# EAGLE design irio (EAGLE 6.6.0)
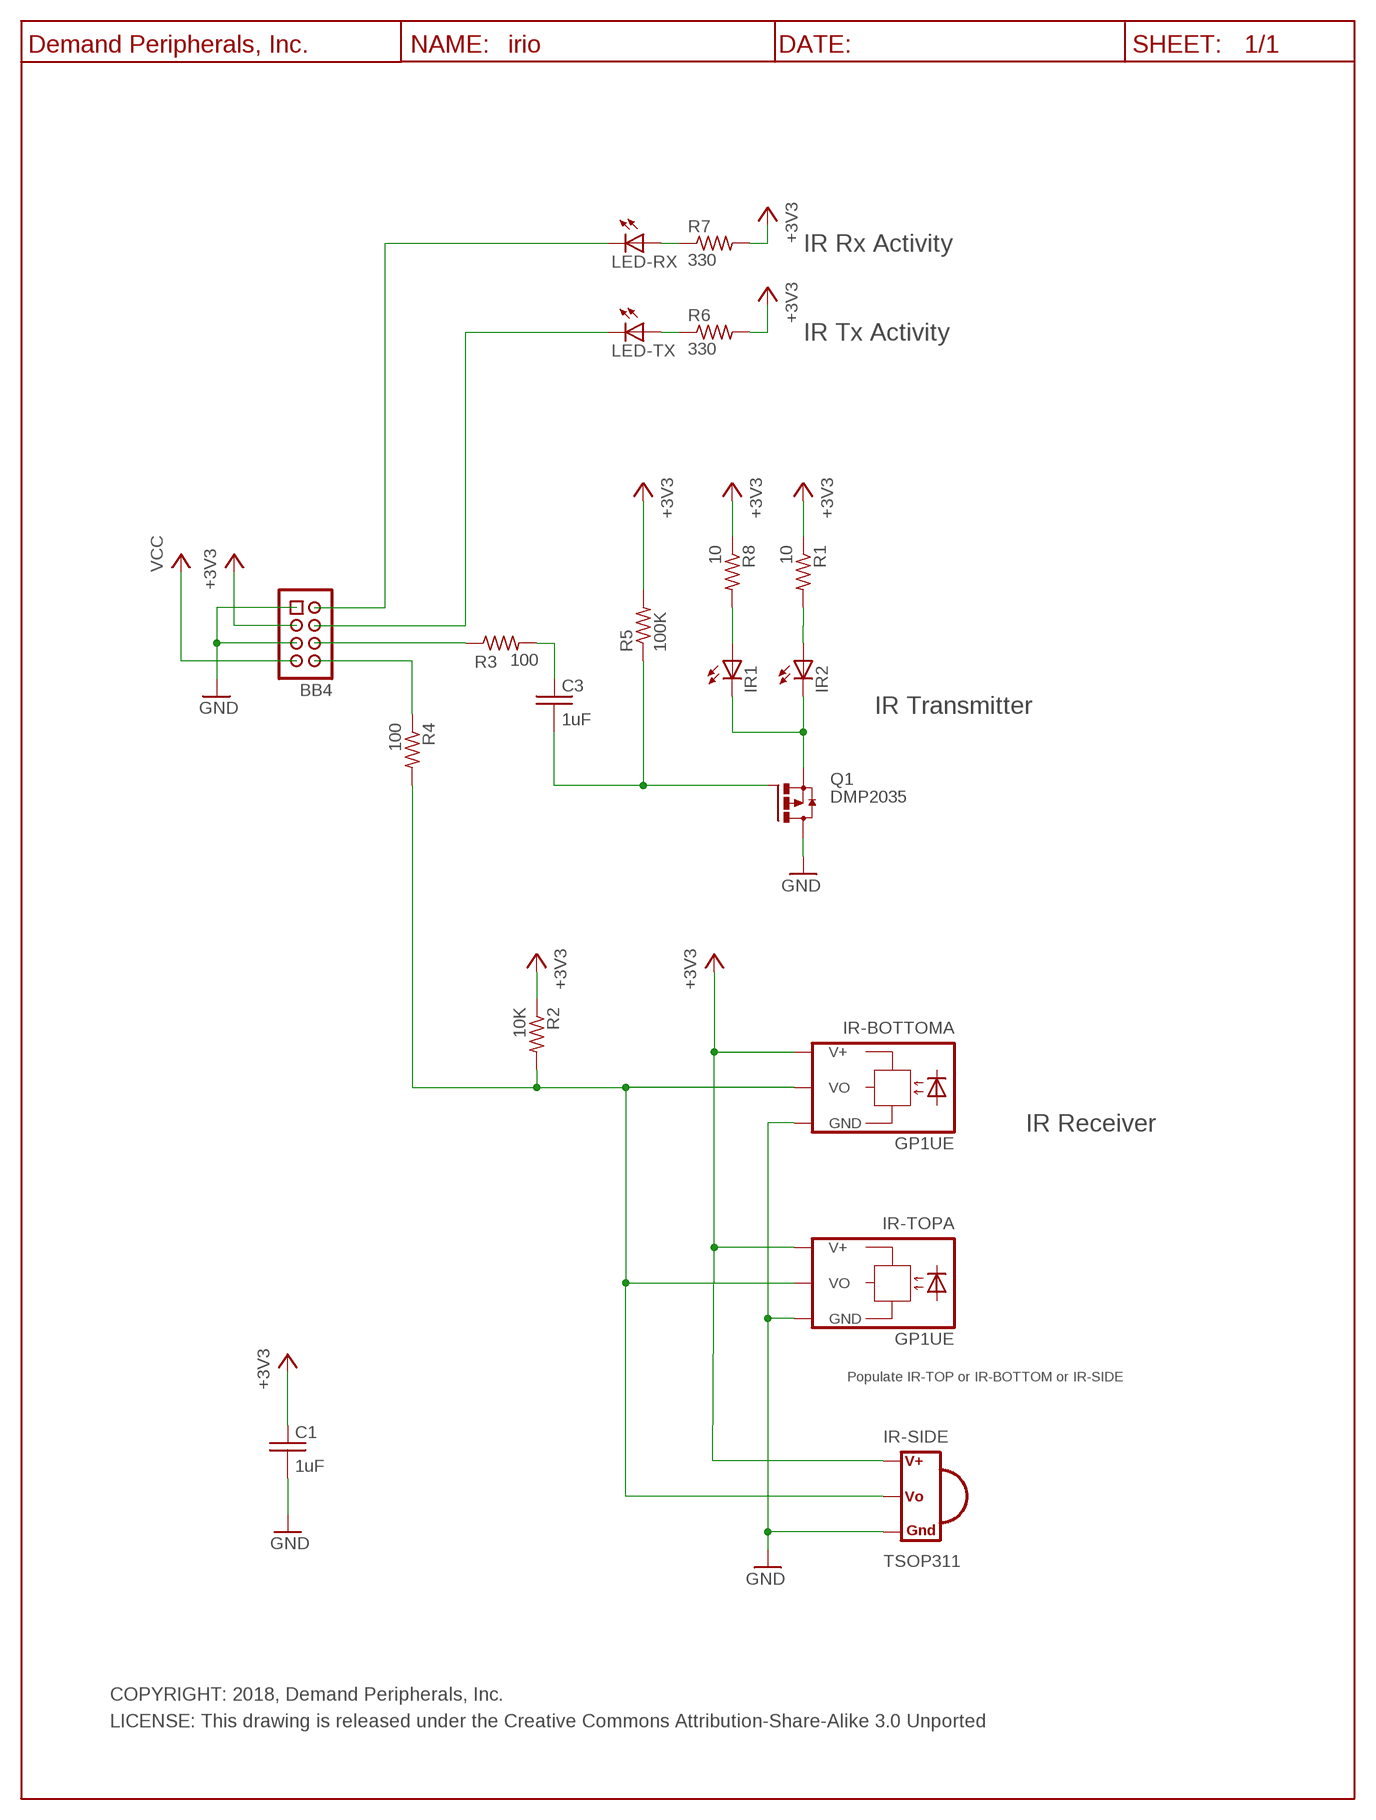
[diagram p0: schematic, sheet 1]

## Parts
BB4  BB4-CON  HDR-4X2-SHR  [HDR-4X2]
C1  1uF  C1.0UF_C0603  [C0603]
C3  1uF  C1.0UF_C0603  [C0603]
IR1  LED-5MM-IR  [LED5MM]
IR2  LED-5MM-IR  [LED5MM]
IR-BOTTOM  GP1UE  [GP1UE]
IR-SIDE  TSOP311  [TSOP-IR-SIDE]
IR-TOP  GP1UE  [GP1UE]
LED-RX  LED  LED-5MM-GRN  [LED5MM]
LED-TX  LED  LED-5MM-RED  [LED5MM]
Q1  DMP2035  [SOT23]
R1  10  R10_R0603  [R0603]
R2  10K  R10K_R0603  [R0603]
R3  100  R100_R0603  [R0603]
R4  100  R100_R0603  [R0603]
R5  100K  R100K_R0603  [R0603]
R6  330  R330_R0603  [R0603]
R7  330  R330_R0603  [R0603]
R8  10  R10_R0603  [R0603]
U$1  DP_FRAME_P  [P_FRAME]

## Nets
+3V3: BB4.3 C1.1 IR-BOTTOM.2(A:V+) IR-SIDE.2(V+) IR-TOP.2(A:V+) R1.1 R2.1 R5.2 R6.2 R7.2 R8.1
GND: BB4.1 BB4.5 C1.2 IR-BOTTOM.3(A:GND) IR-SIDE.3(GND) IR-TOP.3(A:GND) Q1.3(D)
IRRX-DATA: IR-BOTTOM.1(A:VO) IR-SIDE.1(VO) IR-TOP.1(A:VO) R2.2 R4.2
N$1: C3.1 R3.2
N$2: BB4.2 LED-RX.C
N$3: BB4.4 LED-TX.C
N$4: BB4.6 R3.1
N$5: BB4.8 R4.1
N$6: IR1.A R8.2
N$8: C3.2 Q1.1(G) R5.1
N$9: IR2.A R1.2
N$10: IR1.C IR2.C Q1.2(S)
N$15: LED-RX.A R7.1
N$16: LED-TX.A R6.1
VCC: BB4.7
Unconnected: IR-BOTTOM.MNT1(MNT1:G) IR-BOTTOM.MNT2(MNT2:G) IR-TOP.MNT1(MNT1:G) IR-TOP.MNT2(MNT2:G)

## Notes on the sheet
- IR Rx Activity
- IR Tx Activity
- IR Transmitter
- IR Receiver
- Populate IR-TOP or IR-BOTTOM or IR-SIDE
- COPYRIGHT: 2018, Demand Peripherals, Inc.
- LICENSE: This drawing is released under the Creative Commons Attribution-Share-Alike 3.0 Unported

## Library data of the parts
BB4 = dpi-conn:HDR-4X2-SHR: Shrouded 4x2 pin header; VENDOR: Digikey; VENDOR-PART-NUM: 609-3530-ND
C1 C3 = dpi-passive:C1.0UF_: 1.0 uF Capacitor, 25V, Y5V; VENDOR: Digikey; VENDOR-PART-NUM: 490-3897-2-ND
IR1 IR2 = dpi-diopto:LED-5MM-IR: IR LED, 5 MM, through-hole; VENDOR: Digikey; VENDOR-PART-NUM: 1080-1087-ND
IR-BOTTOM IR-TOP = dpi-swsens:GP1UE: IR recv, 38KHz, Top View; VENDOR: Digikey; VENDOR-PART-NUM: 497-14946-1-ND
IR-SIDE = dpi-swsens:TSOP311: Vishay TSOP311 IR receiver, side view; VENDOR: Digikey; VENDOR-PART-NUM: TSOP31138-ND
LED-RX = dpi-diopto:LED-5MM-GRN: Green LED, 5 MM, through-hole; VENDOR: Digikey; VENDOR-PART-NUM: 160-1852-ND
LED-TX = dpi-diopto:LED-5MM-RED: Red LED, 5 MM, through-hole; VENDOR: Digikey; VENDOR-PART-NUM: 160-1853-ND
Q1 = dpi-transic:DMP2035: PFET; VENDOR: Digikey; VENDOR-PART-NUM: DMP2035U-7DICT-ND
R1 R8 = dpi-passive:R10_: 10 Ohm resistor, 1%, 0.1 watt; VENDOR: Digikey; VENDOR-PART-NUM: 311-10.0HRTR-ND
R2 = dpi-passive:R10K_: 10K Resistor, 1%, 0.1 watt; VENDOR: Digikey; VENDOR-PART-NUM: 311-1.00KHRTR-ND
R3 R4 = dpi-passive:R100_: 100 Ohm resistor, 1%, 0.1 watt; VENDOR: Digikey; VENDOR-PART-NUM: 311-100HRTR-ND
R5 = dpi-passive:R100K_: 100K Resistor, 1%, 0.1 watt; VENDOR: Digikey; VENDOR-PART-NUM: 311-100KHRTR-ND
R6 R7 = dpi-passive:R330_: 330 Ohm resistor, 1%, 0.1 watt; VENDOR: Digikey; VENDOR-PART-NUM: 311-330HRTR-ND
U$1 = dpi-sym:DP_FRAME_P: Portrait/Letter Document Frame

## Board
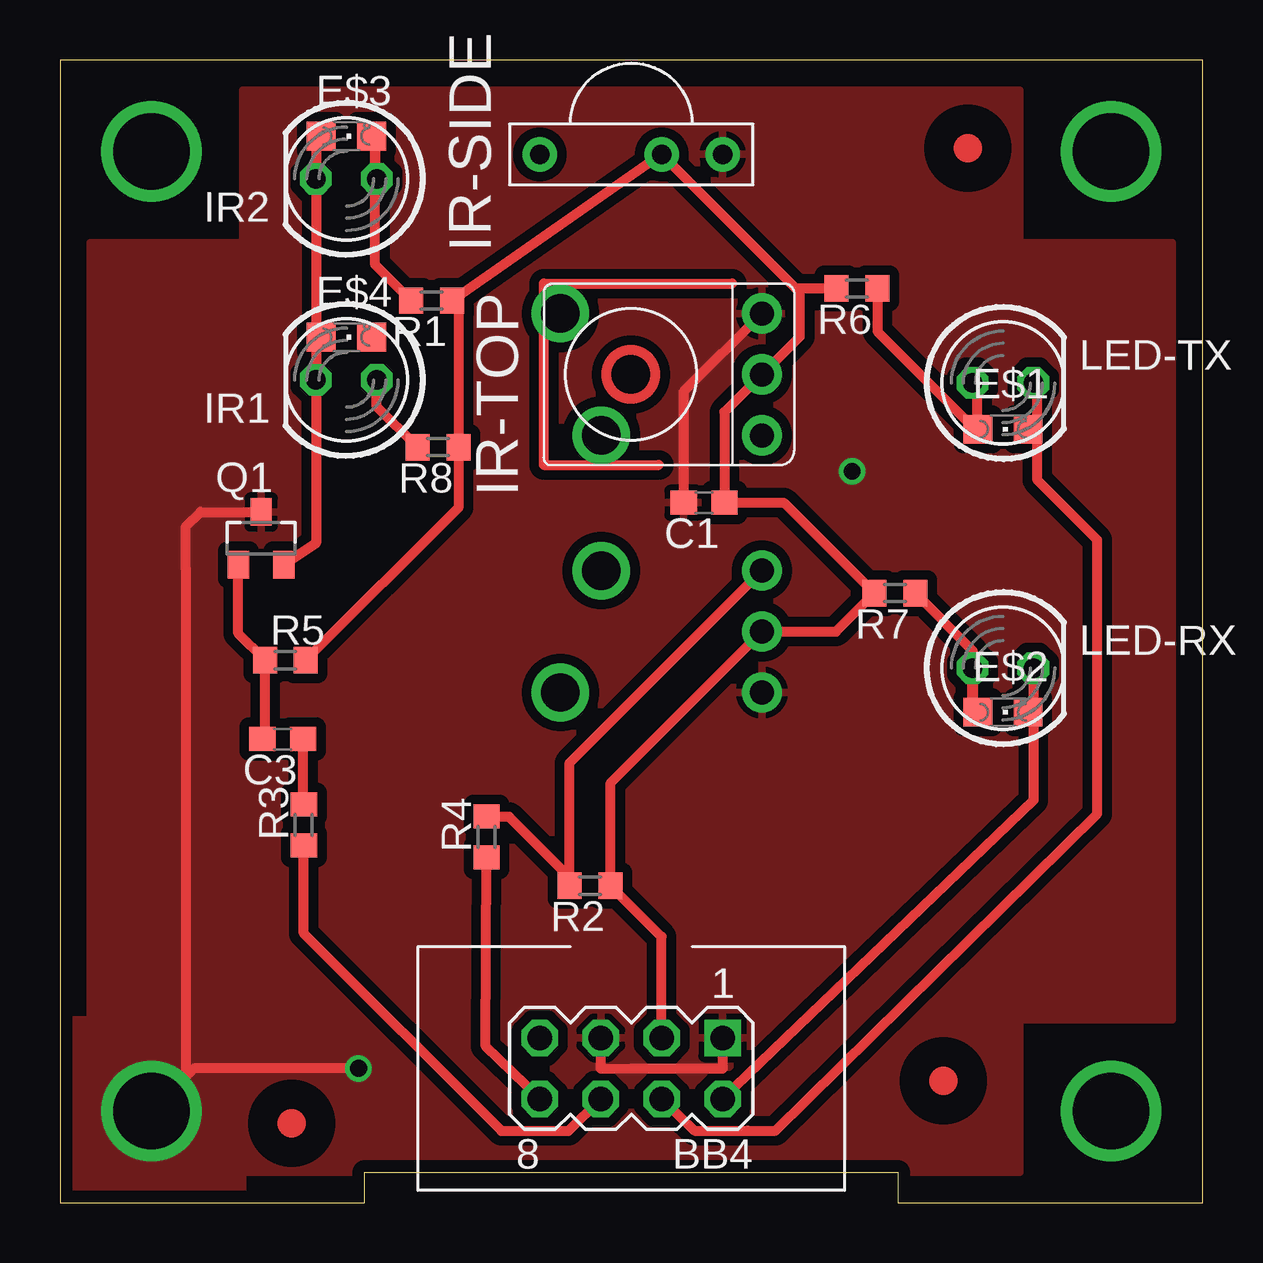
[diagram p1: board, top side]
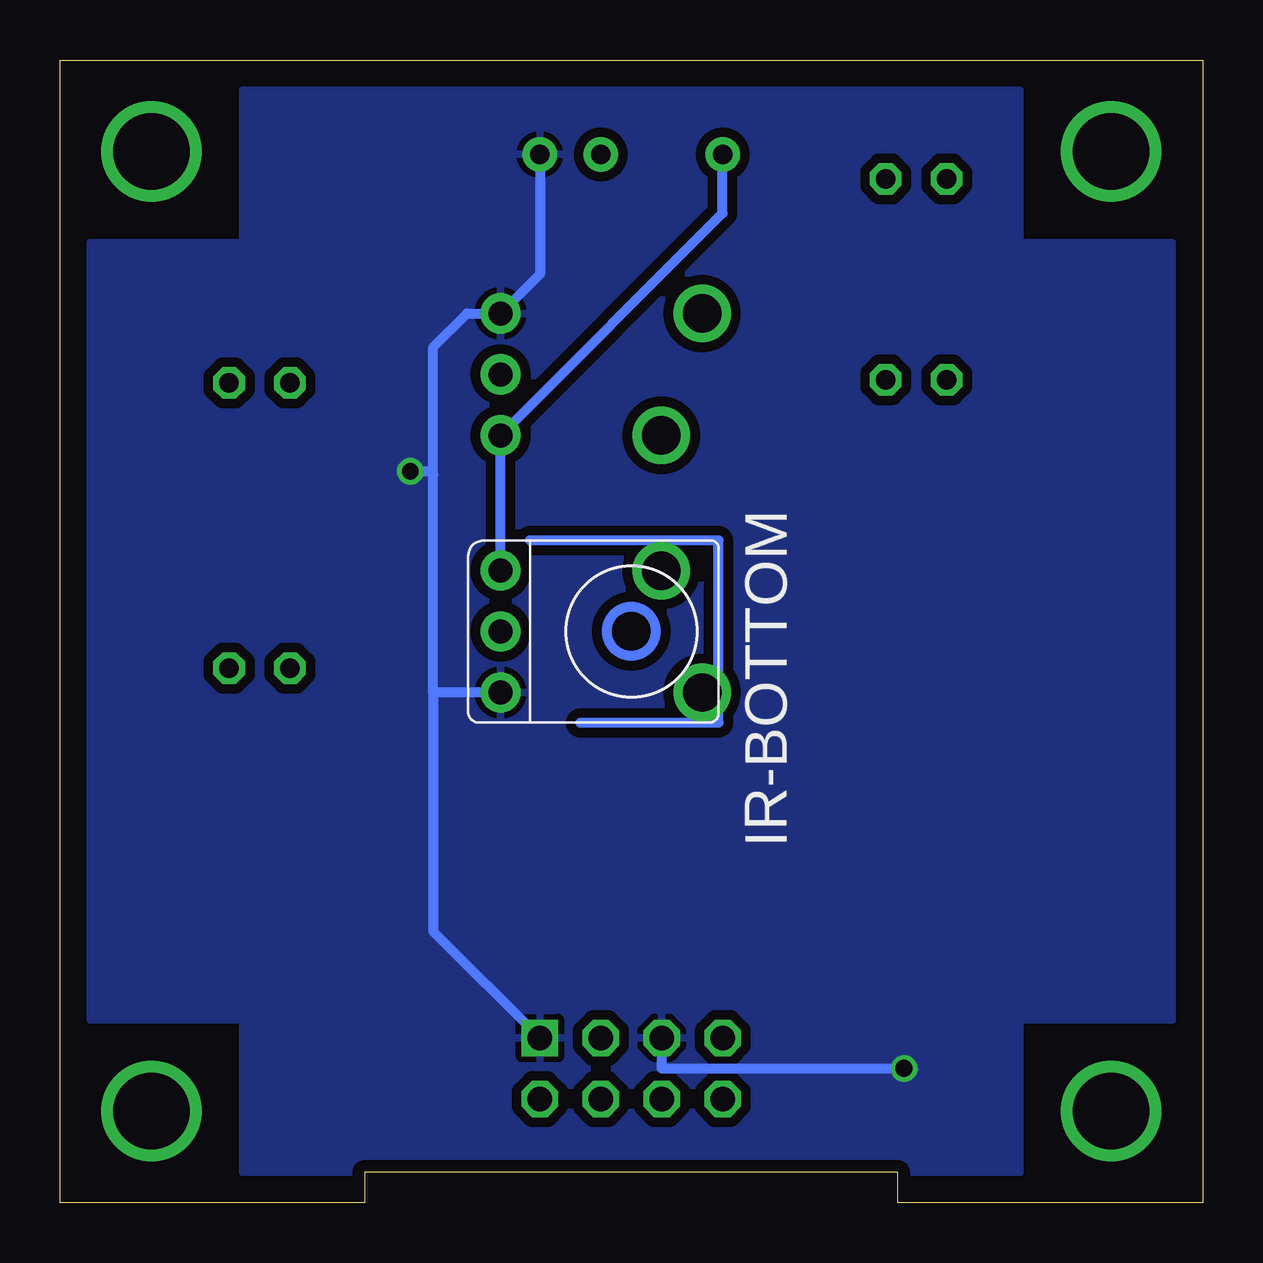
[diagram p2: board, bottom side, seen from below]

Size 47.62 x 47.62 mm. Coordinates in mm from the lower left corner, seen from the top.
Outline: 0,0 12.7,0 12.7,1.27 34.92,1.27 34.92,0 47.62,0 47.62,47.62 0,47.62 0,0
Copper layers (1*16): Top 0.035mm / dielectric 1.5mm / Bottom 0.035mm
Design rules "default *": minimum track width 10mil, minimum drill 24mil, track to track 8mil, track to pad 8mil, pad to pad 8mil, via to via 8mil, smd to smd 8mil, copper to edge 20mil, drill to drill 8mil, minimum pad ring 10mil, minimum via ring 8mil, stop-mask expansion 4mil, vias tented up to drill 50mil, thermal gap 10mil
tKeepout: area 15.1,1 to 32.5,9.7; area 15.1,1 to 32.5,9.7

### Footprints (pad centres in the part's own frame; a part is rotated, then mirrored left to right if it is on the bottom)
HDR-4X2 = drill 1.016 square: 1 -3.81,-1.27 | drill 1.016 octagon: 2 -3.81,1.27; 3 -1.27,-1.27; 4 -1.27,1.27; 5 1.27,-1.27; 6 1.27,1.27; 7 3.81,-1.27; 8 3.81,1.27
C0603 = smd 1.1 x 1: 1 -0.85,0; 2 0.85,0
CHIPLED_0805 = smd 1.2 x 1.2: A 0,-1.05; C 0,1.05
LED5MM = drill 0.813 octagon: A -1.27,0; C 1.27,0
GP1UE = drill 1 pad 1.676: 1 0,-2.54; 2 0,0; 3 0,2.54 | drill 1.6: MNT1 -8.4,2.54; MNT2 -6.7,-2.54
TSOP-IR-SIDE = drill 0.8 pad 1.422: 1 0,5.08; 2 0,0; 3 0,-2.54
SOT23 = smd 0.889 x 1.143: 1 -0.95,-1.1; 2 0.95,-1.1; 3 0,1.1
R0603 = smd 1 x 1.1: 1 -0.85,0; 2 0.85,0

### Placement (x,y rotation side)
BB4  23.81,5.59 180 top
C1  26.85,29.17 180 top
C3  9.28,19.32 180 top
E$1  [CHIPLED_0805]  39.31,32.23 270 top
E$2  [CHIPLED_0805]  39.31,20.43 270 top
E$3  [CHIPLED_0805]  11.94,44.45 270 top
E$4  [CHIPLED_0805]  11.94,36.07 270 top
IR1  11.94,34.29 180 top
IR2  11.94,42.67 180 top
IR-BOTTOM  29.26,23.8 180 bottom
IR-SIDE  25.08,43.69 90 top
IR-TOP  29.26,34.52 0 top
LED-RX  39.31,22.28 0 top
LED-TX  39.31,34.16 0 top
Q1  8.38,27.69 0 top
R1  15.49,37.59 180 top
R2  22.1,13.21 180 top
R3  10.16,15.74 90 top
R4  17.78,15.24 90 top
R5  9.4,22.61 0 top
R6  33.22,38.1 180 top
R7  34.8,25.4 180 top
R8  15.76,31.48 180 top
U$1  -2.54,-2.54 0 top
U$2  [DPI-2]  42.42,10.67 90 bottom
U$4  [FIDUCIAL]  37.85,43.94 0 top
U$5  [FIDUCIAL]  9.65,3.3 0 top
U$6  [FIDUCIAL]  36.83,5.08 0 top

### Tracks (layer width: path | path; a pad name or v marks a point on that pad's centre or on a via)
+3V3
  Top 0.406: R6.2 30.84,38.1 | 30.84,38.1 30.67,38.1 IR-SIDE.2 R1.1 16.61,37.33 R8.1 16.61,28.97 R5.2 | 30.84,38.1 30.84,36.09 IR-TOP.2 27.7,32.96 C1.1 30.18,29.17 R7.2 32.35,23.8 IR-BOTTOM.2 22.95,17.49 R2.1 25.08,11.07 BB4.3
FRAME
  Bottom 0.406: 28.04,27.6 20.17,27.6 20.17,20.9 20.17,19.99 25.93,19.99
GND  (via drill 0.7, 3.17 pad 3.17)
  Top 0.406: BB4.1 27.64,5.59 23.81,5.59 22.54,5.58 BB4.5 | IR-TOP.3 26,33.8 C1.2 | v12.45,5.59 5.59,5.59 v3.81,3.81 5.25,5.25 5.25,26.42 5.25,28.18 5.86,28.79 Q1.3
  Bottom 0.406: 32.07,21.2 32.07,30.34 | 32.07,30.34 32.07,35.65 30.66,37.06 IR-TOP.3 27.62,38.7 IR-SIDE.3 27.62,44.16 | 32.07,21.2 32.07,11.3 BB4.1 | IR-BOTTOM.3 32,21.26 32.07,21.2 | v33.02,30.48 32.21,30.48 32.07,30.34 | BB4.5 22.54,5.59 v12.45,5.59
  pour Top (isolate 0.406): 0.51,0.51 0.51,7.62 1.27,7.62 1.27,40.01 7.62,40.01 7.62,46.35 40.01,46.35 40.01,40.01 46.35,40.01 46.35,7.62 40.01,7.62 40.01,1.27 7.62,1.27 7.62,0.51
  pour Bottom (isolate 0.406): 7.62,1.27 7.62,7.62 1.27,7.62 1.27,40.01 7.62,40.01 7.62,46.35 40.01,46.35 40.01,40.01 46.35,40.01 46.35,7.62 40.01,7.62 40.01,1.27
IRRX-DATA
  Top 0.406: R4.2 17.79,16.08 18.72,16.08 21.25,13.55 R2.2 21.25,18.33 IR-BOTTOM.1
  Bottom 0.406: IR-SIDE.1 20,41.24 IR-TOP.1 IR-BOTTOM.1
MOUNT  (via drill 3.17 pad 3.17)
  other vias: 43.81,43.81
N$1
  Top 0.406: R3.2 10.13,16.61 C3.1
N$2
  Top 0.406: LED-RX.C 40.58,16.76 BB4.2
N$3
  Top 0.406: BB4.4 26.45,3 28.66,3 29.83,3 43.23,16.2 43.23,27.62 40.74,30.11 40.74,34 LED-TX.C
N$4
  Top 0.406: BB4.6 21.2,2.98 18.4,2.98 10.16,11.23 R3.1
N$5
  Top 0.406: BB4.8 17.74,6.51 R4.1
N$6
  Top 0.406: R8.2 13.21,33.19 IR1.A
N$7  (via drill 3.17)
  other vias: 3.81,43.81
N$8
  Top 0.406: C3.2 8.55,19.43 R5.1 7.43,23.72 Q1.1
N$9
  Top 0.406: R1.2 13.14,39.09 13.14,44.46 13.14,42.67 IR2.A
N$10
  Top 0.406: IR2.C 10.67,44.42 10.71,44.46 10.71,34.33 IR1.C 10.67,27.48 Q1.2
N$11
  Top 0.406: 28.02,38.3 20.17,38.3 20.17,31.22 20.17,30.75 24.97,30.75
N$15
  Top 0.406: R7.1 38.05,23 38.05,20.23 38.04,20.24 LED-RX.A
N$16
  Top 0.406: R6.1 34.07,36.31 38.24,32.14 38.24,33.96 LED-TX.A
N$18  (via drill 3.17 pad 3.17)
  other vias: 43.81,3.81
(copper drawn outside any net)
  shapes: Bottom circle x1, Top circle x1

### Text on the board
tTest: 1.875 Inches | 1.575 Inches | IR-SIDE | IR2 | R6 | IR1 | R1 | IRIO, Rev 19a | IR-TOP | R8 | C1 | Tx | R7 | Q1 | R5 | C3 | IR-BOTTOM | Rx | 1.575 Inches | 1.875 Inches | R4 | R3 | R2 | BB4 | (C) 2019, Demand Peripherals, Inc.